# EAGLE design HandheldOsc (EAGLE 9.6.2)
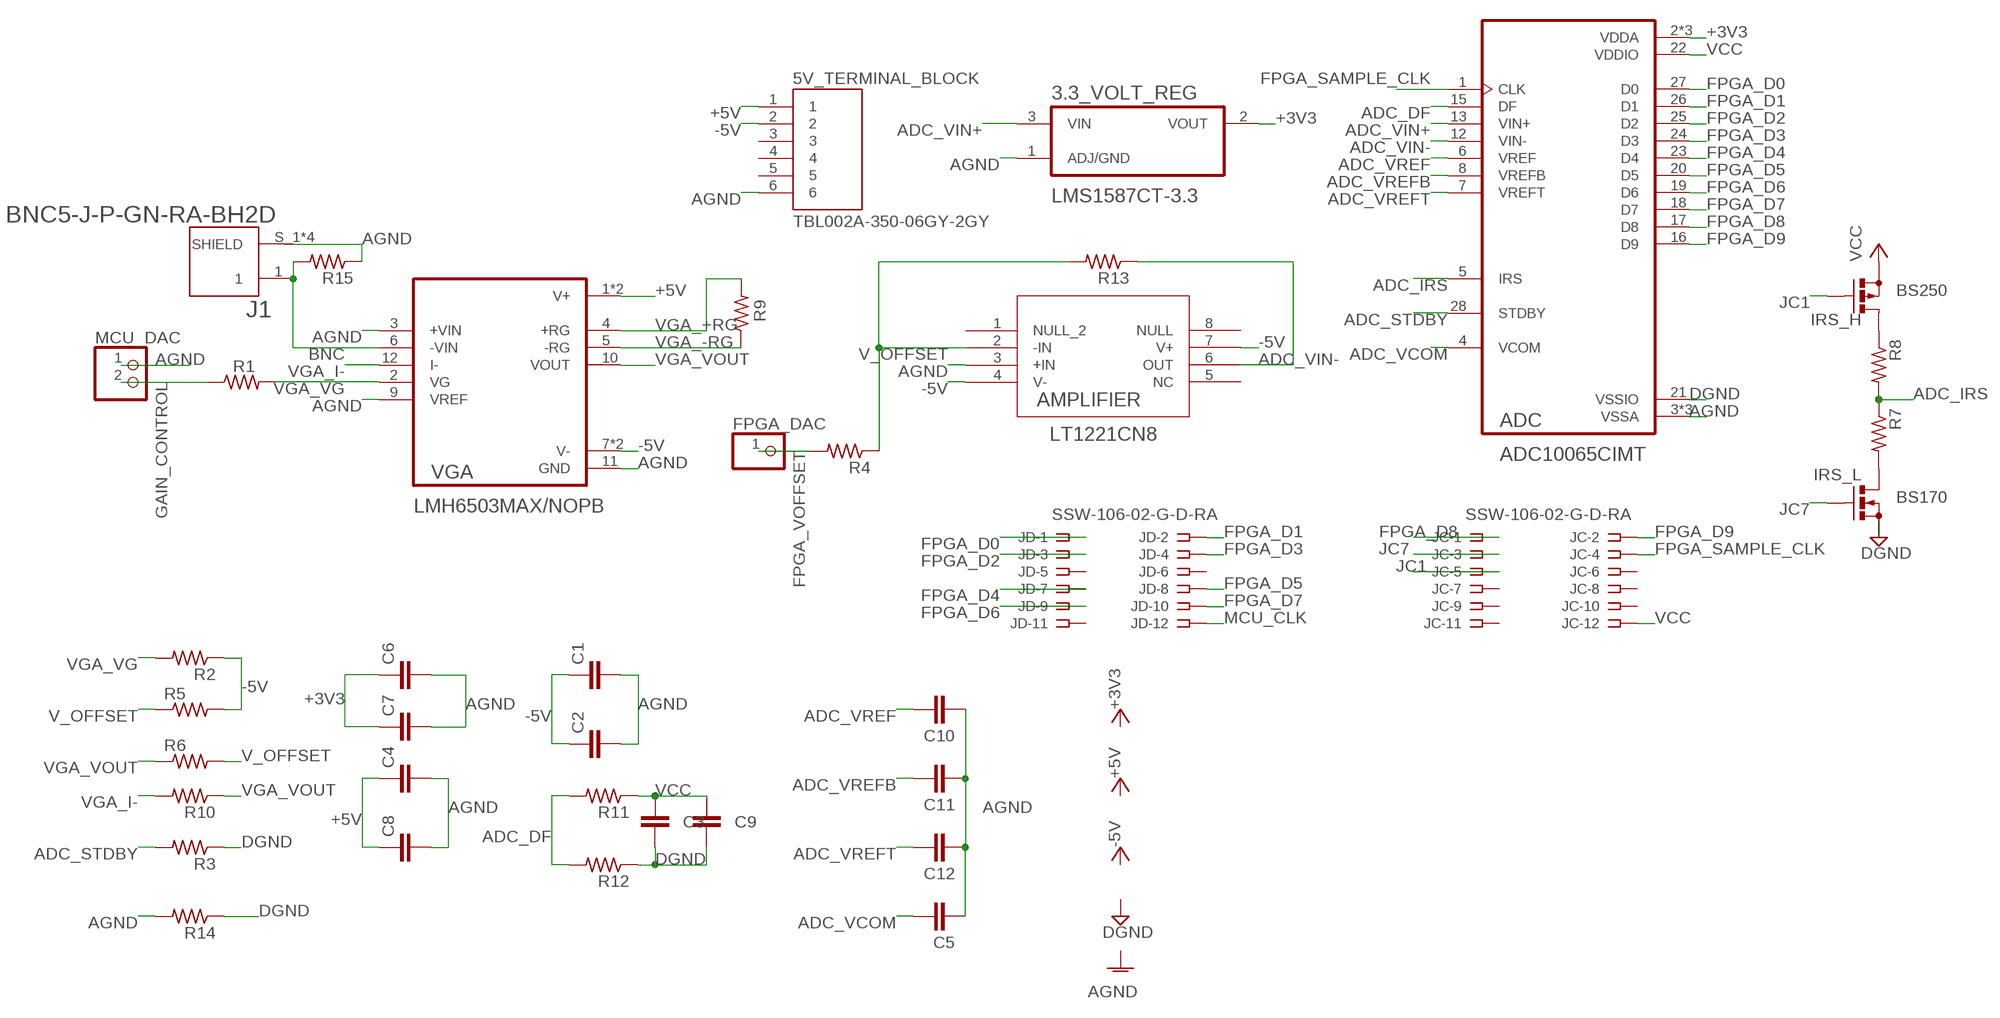
[diagram p0: schematic, sheet 1]

## Parts
3.3_VOLT_REG  LMS1587CT-3.3  [TO254P1054X470X1955-3]
5V_TERMINAL_BLOCK  TBL002A-350-06GY-2GY  [CUI_TBL002A-350-06GY-2GY]
ADC  ADC10065CIMT  [SOP65P640X120-28N]
AMPLIFIER  LT1221CN8  [PDIP-8_N]
C1  C2,5-3  [C2.5-3]
C2  C2,5-3  [C2.5-3]
C3  C2,5-3  [C2.5-3]
C4  C2,5-3  [C2.5-3]
C5  C2,5-3  [C2.5-3]
C6  C2,5-3  [C2.5-3]
C7  C2,5-3  [C2.5-3]
C8  C2,5-3  [C2.5-3]
C9  C2,5-3  [C2.5-3]
C10  C2,5-3  [C2.5-3]
C11  C2,5-3  [C2.5-3]
C12  C2,5-3  [C2.5-3]
FPGA_DAC  PINHD-1X1  [1X01]
IRS_H  BS250  [SOT54E]
IRS_L  BS170  [SOT54E]
J1  BNC5-J-P-GN-RA-BH2D  [SAMTEC_BNC5-J-P-GN-RA-BH2D]
JC  SSW-106-02-G-D-RA  [SSW-106-02-G-D-RA]
JD  SSW-106-02-G-D-RA  [SSW-106-02-G-D-RA]
MCU_DAC  PINHD-1X2  [1X02]
R1  R-US_0207/12  [0207/12]
R2  R-US_0207/12  [0207/12]
R3  R-US_0207/12  [0207/12]
R4  R-US_0207/12  [0207/12]
R5  R-US_0207/12  [0207/12]
R6  R-US_0207/12  [0207/12]
R7  R-US_0207/12  [0207/12]
R8  R-US_0207/12  [0207/12]
R9  R-US_0207/12  [0207/12]
R10  R-US_0207/12  [0207/12]
R11  R-US_0207/12  [0207/12]
R12  R-US_0207/12  [0207/12]
R13  R-US_0207/12  [0207/12]
R14  R-US_0207/12  [0207/12]
R15  R-US_0207/12  [0207/12]
VGA  LMH6503MAX/NOPB  [SOIC127P600X175-14N]

## Nets
+3V3: 3.3_VOLT_REG.2(VOUT) ADC.2(VDDA) ADC.9(VDDA) ADC.10(VDDA) C6.1 C7.1
+5V: 5V_TERMINAL_BLOCK.1 C4.1 C8.1 VGA.1(V+) VGA.14(V+)
-5V: 5V_TERMINAL_BLOCK.2 AMPLIFIER.4(V-) AMPLIFIER.7(V+) C1.1 C2.1 R2.1 R5.2 VGA.7(V-) VGA.8(V-)
ADC_DF: ADC.15(DF) R11.2 R12.2
ADC_IRS: ADC.5(IRS) R7.1 R8.2
ADC_STDBY: ADC.28(STDBY) R3.2
ADC_VCOM: ADC.4(VCOM) C5.1
ADC_VIN+: 3.3_VOLT_REG.3(VIN) ADC.13(VIN+)
ADC_VIN-: ADC.12(VIN-) AMPLIFIER.6(OUT) R13.1
ADC_VREF: ADC.6(VREF) C10.1
ADC_VREFB: ADC.8(VREFB) C11.1
ADC_VREFT: ADC.7(VREFT) C12.1
AGND: 3.3_VOLT_REG.1(ADJ/GND) 5V_TERMINAL_BLOCK.6 ADC.3(VSSA) ADC.11(VSSA) ADC.14(VSSA) AMPLIFIER.3(+IN) C1.2 C2.2 C4.2 C5.2 C6.2 C7.2 C8.2 C10.2 C11.2 C12.2 J1.S_1(SHIELD) J1.S_2(SHIELD) J1.S_3(SHIELD) J1.S_4(SHIELD) MCU_DAC.1 R14.2 R15.1 VGA.3(+VIN) VGA.9(VREF) VGA.11(GND)
BNC: J1.1 R15.2 VGA.6(-VIN)
DGND: ADC.21(VSSIO) C3.2 C9.2 IRS_L.S R3.1 R12.1 R14.1
FPGA_D0: ADC.27(D0) JD.1
FPGA_D1: ADC.26(D1) JD.2
FPGA_D2: ADC.25(D2) JD.3
FPGA_D3: ADC.24(D3) JD.4
FPGA_D4: ADC.23(D4) JD.7
FPGA_D5: ADC.20(D5) JD.8
FPGA_D6: ADC.19(D6) JD.9
FPGA_D7: ADC.18(D7) JD.10
FPGA_D8: ADC.17(D8) JC.1
FPGA_D9: ADC.16(D9) JC.2
FPGA_SAMPLE_CLK: ADC.1(CLK) JC.4
FPGA_VOFFSET: FPGA_DAC.1 R4.2
GAIN_CONTROL: MCU_DAC.2 R1.1
JC1: IRS_H.G JC.5
JC7: IRS_L.G JC.3
MCU_CLK: JD.12
N$1: IRS_H.D R8.1
N$2: IRS_L.D R7.2
V_OFFSET: AMPLIFIER.2(-IN) R4.1 R5.1 R6.2 R13.2
VCC: ADC.22(VDDIO) C3.1 C9.1 IRS_H.S JC.12 R11.1
VGA_+RG: R9.2 VGA.4(+RG)
VGA_-RG: R9.1 VGA.5(-RG)
VGA_I-: R10.2 VGA.12(I-)
VGA_VG: R1.2 R2.2 VGA.2(VG)
VGA_VOUT: R6.1 R10.1 VGA.10(VOUT)
Unconnected: 5V_TERMINAL_BLOCK.3 5V_TERMINAL_BLOCK.4 5V_TERMINAL_BLOCK.5 AMPLIFIER.1(NULL_2) AMPLIFIER.5(NC) AMPLIFIER.8(NULL) JC.6 JC.7 JC.8 JC.9 JC.10 JC.11 JD.5 JD.6 JD.11

## Library data of the parts
3.3_VOLT_REG = LMS1587CT-3.3:LMS1587CT-3.3: Check prices <https://pricing.snapeda.com/parts/LMS1587CT-3.3/NOPB/Texas%20Instruments/view-part?ref=eda>; AVAILABILITY: Warning; DESCRIPTION: 3-A, 13-V, linear voltage regulator 3-TO-220 0 to 125; MF: Texas Instruments; MP: LMS1587CT-3.3/NOPB; PACKAGE: TO-220-3 Texas Instruments; PRICE: None; PURCHASE-URL: https://pricing.snapeda.com/search/part/LMS1587CT-3.3/NOPB/?ref=eda
5V_TERMINAL_BLOCK = TBL002A-350-06GY-2GY:TBL002A-350-06GY-2GY: Check prices <https://pricing.snapeda.com/parts/TBL002A-350-06GY-2GY/CUI%20Devices/view-part?ref=eda>; AVAILABILITY: Good; CUI_PURCHASE_URL: https://www.cuidevices.com/product/interconnect/connectors/terminal-blocks/tbl002a-350-series?utm_source=snapeda.com&utm_medium=referral&utm_campaign=snapedaBOM; DESCRIPTION: 1~24 Poles, Screwless, 45°, 3.50 Pitch, 24~20 (AWG), Terminal Block Connector; MF: CUI Devices; MP: TBL002A-350-06GY-2GY; PACKAGE: None; PRICE: None; PURCHASE-URL: https://pricing.snapeda.com/search/part/TBL002A-350-06GY-2GY/?ref=eda
ADC = ADC10065CIMT:ADC10065CIMT; DESCRIPTION: 10 Bit Analog to Digital Converter 1 Input 1 Pipelined 28-TSSOP; DIGI-KEY_PART_NUMBER: 296-35231-2-ND; MF: Texas Instruments; MP: ADC10065CIMT; PACKAGE: TSSOP-28 Texas Instruments
AMPLIFIER = LT1221CN8:LT1221CN8; DESCRIPTION: General Purpose Amplifier 1 Circuit 8-PDIP; DIGI-KEY_PART_NUMBER: LT1221CN8#PBF-ND; MF: Linear Technology; MP: LT1221CN8; PACKAGE: DIP-8 Linear Technology
C1-C12 = capacitor-wima:C: CAPACITOR naming: grid - package width
FPGA_DAC = pinhead:PINHD-1X1: PIN HEADER
IRS_H = transistor-small-signal:BS250: P-CHANNEL MOS FET
IRS_L = transistor-small-signal:BS170: N-CHANNEL MOS FET
J1 = BNC5-J-P-GN-RA-BH2D:BNC5-J-P-GN-RA-BH2D: Conn BNC F 50Ohm Solder RA Thru-Hole Gold Over Nickel; DESCRIPTION: BNC Connector Jack, Female Socket 50Ohm Panel Mount, Through Hole, Right Angle Solder; DIGI-KEY_PART_NUMBER: SAM9177-ND; MF: Samtec; MP: BNC5-J-P-GN-RA-BH2D; PACKAGE: None; PURCHASE-URL: https://pricing.snapeda.com/search/part/BNC5-J-P-GN-RA-BH2D/?ref=eda
JC JD = con-samtec:SSW-106-02-G: THROUGH-HOLE .025" SQ POST SOCKET Source: Samtec SSW.pdf; MF: Samtec Inc.; MPN: SSW-106-02-G-D-RA; OC_FARNELL: unknown; OC_NEWARK: 11P9415
MCU_DAC = pinhead:PINHD-1X2: PIN HEADER
R1-R15 = rcl:R-US_: RESISTOR, American symbol; SPICEPREFIX: R
VGA = LMH6503MAX_NOPB:LMH6503MAX/NOPB; DESCRIPTION: Wideband, Low Power, Linear Variable Gain Amplifier 14-SOIC -40 to 85; DIGI-KEY_PART_NUMBER: 296-35331-1-ND; MF: Texas Instruments; MP: LMH6503MAX/NOPB; PACKAGE: SOIC-14 Texas Instruments; PURCHASE-URL: https://pricing.snapeda.com/search/part/LMH6503MAX/NOPB/?ref=eda

## Board
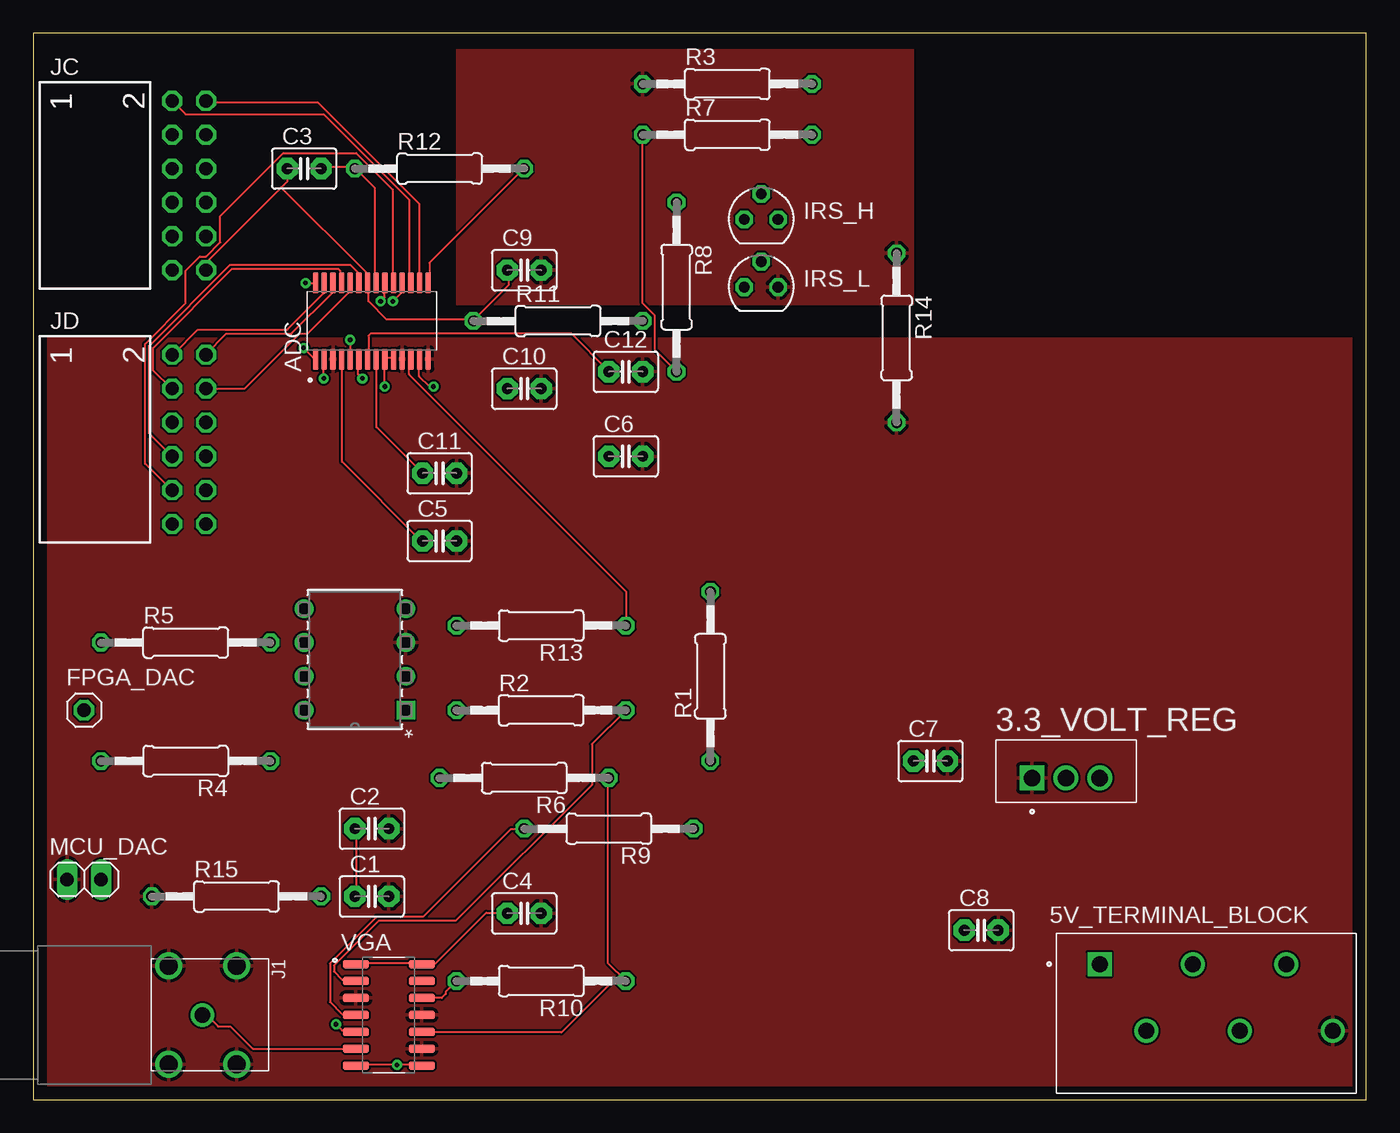
[diagram p1: board, top side]
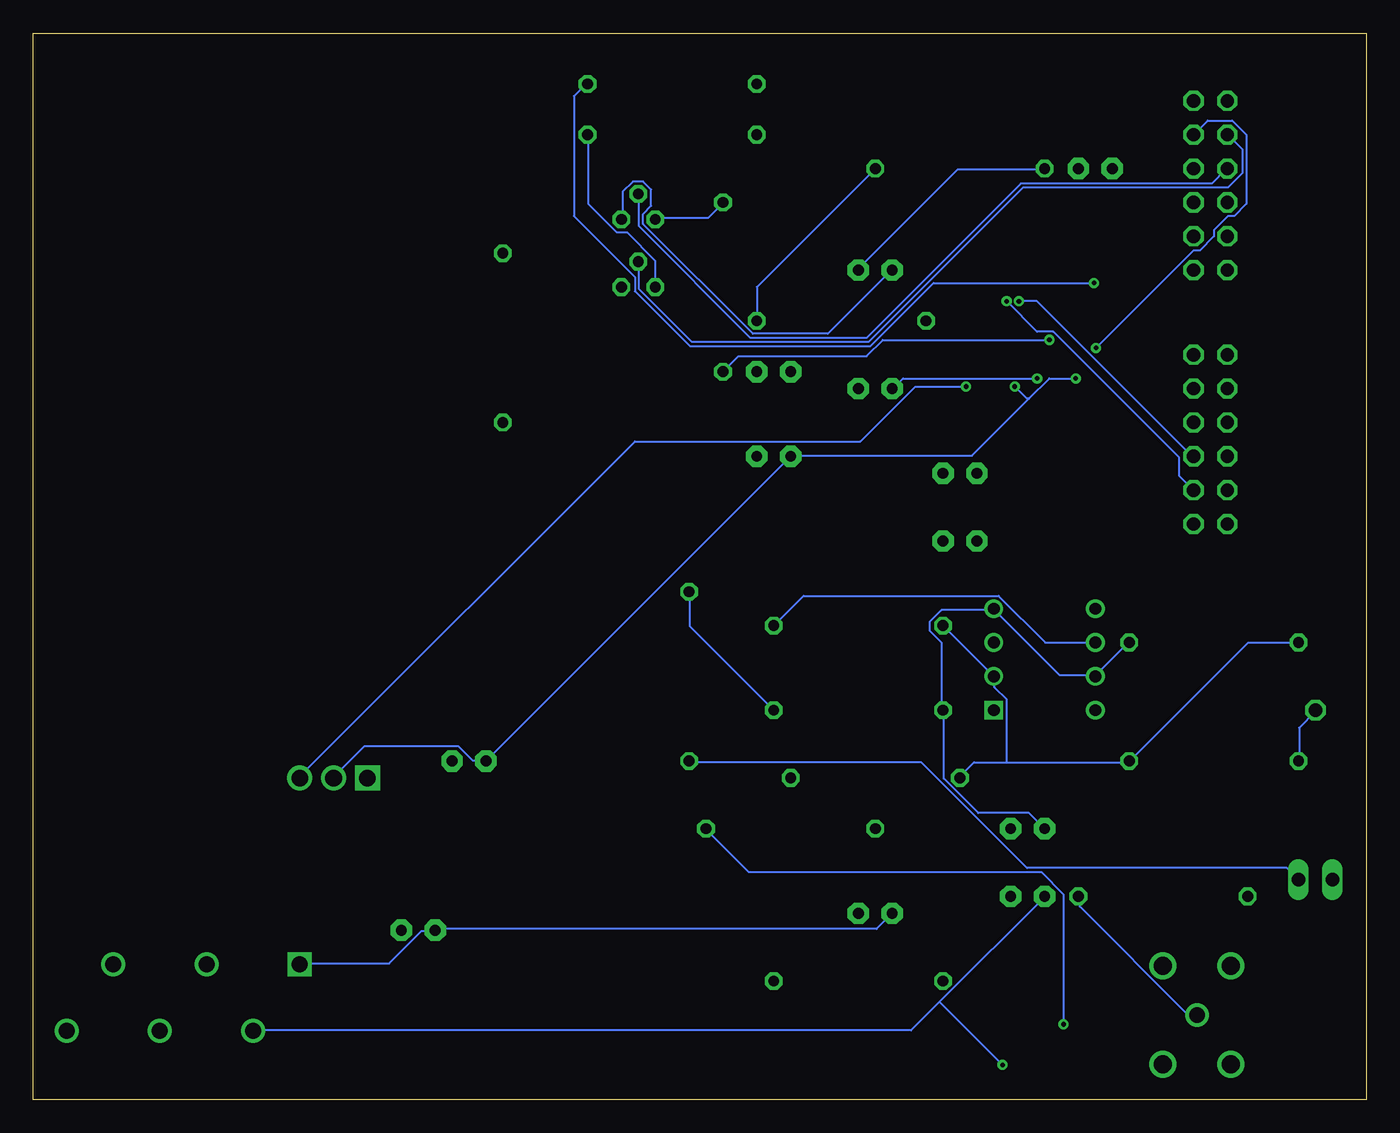
[diagram p2: board, bottom side, seen from below]

Size 100 x 80 mm. Coordinates in mm from the lower left corner, seen from the top.
Outline: 0,0 100,0 100,80 0,80 0,0
Copper layers (1*16): Top 0.035mm / dielectric 1.5mm / Bottom 0.035mm
Design rules "default": minimum track width 6mil, minimum drill 0.35mm, track to track 6mil, track to pad 6mil, pad to pad 6mil, via to via 6mil, smd to smd 6mil, copper to edge 40mil, drill to drill 6mil, minimum pad ring 10mil, minimum via ring 8mil, stop-mask expansion 4mil, vias tented up to drill 0mil, thermal gap 10mil

### Footprints (pad centres in the part's own frame; a part is rotated, then mirrored left to right if it is on the bottom)
TO254P1054X470X1955-3 = drill 1.24 square: 1 -2.54,0 | drill 1.24: 2 0,0; 3 2.54,0
CUI_TBL002A-350-06GY-2GY = drill 1.2 square: 1 0,0 | drill 1.2: 2 3.5,-5; 3 7,0; 4 10.5,-5; 5 14,0; 6 17.5,-5
SOP65P640X120-28N = smd 1.57 x 0.41: 1 -2.87,4.225; 2 -2.87,3.575; 3 -2.87,2.925; 4 -2.87,2.275; 5 -2.87,1.625; 6 -2.87,0.975; 7 -2.87,0.325; 8 -2.87,-0.325; 9 -2.87,-0.975; 10 -2.87,-1.625; 11 -2.87,-2.275; 12 -2.87,-2.925; 13 -2.87,-3.575; 14 -2.87,-4.225; 15 2.87,-4.225; 16 2.87,-3.575; 17 2.87,-2.925; 18 2.87,-2.275; 19 2.87,-1.625; 20 2.87,-0.975; 21 2.87,-0.325; 22 2.87,0.325; 23 2.87,0.975; 24 2.87,1.625; 25 2.87,2.275; 26 2.87,2.925; 27 2.87,3.575; 28 2.87,4.225
PDIP-8_N = drill 0.889 pad 1.397 square: 1 -7.62,7.62 | drill 0.889 pad 1.397: 2 -7.62,5.08; 3 -7.62,2.54; 4 -7.62,0; 5 0,0; 6 0,2.54; 7 0,5.08; 8 0,7.62
C2.5-3 = drill 0.813 pad 1.6 octagon: 1 -1.27,0; 2 1.27,0
1X01 = drill 1.016 octagon: 1 0,0
SOT54E = drill 0.813 octagon: D -1.27,0; G 0,1.905; S 1.27,0
SAMTEC_BNC5-J-P-GN-RA-BH2D = drill 1.17: 1 0,0 | drill 1.35: S_1 -3.7,-2.54; S_2 3.7,-2.54; S_3 3.7,2.54; S_4 -3.7,2.54
SSW-106-02-G-D-RA = drill 1 pad 1.5 octagon: 1 -6.35,1.524; 2 -6.35,4.064; 3 -3.81,1.524; 4 -3.81,4.064; 5 -1.27,1.524; 6 -1.27,4.064; 7 1.27,1.524; 8 1.27,4.064; 9 3.81,1.524; 10 3.81,4.064; 11 6.35,1.524; 12 6.35,4.064
1X02 = drill 1.016 long: 1 -1.27,0; 2 1.27,0
0207/12 = drill 0.813 octagon: 1 -6.35,0; 2 6.35,0
SOIC127P600X175-14N = smd 1.97 x 0.6: 1 -2.475,3.81; 2 -2.475,2.54; 3 -2.475,1.27; 4 -2.475,0; 5 -2.475,-1.27; 6 -2.475,-2.54; 7 -2.475,-3.81; 8 2.475,-3.81; 9 2.475,-2.54; 10 2.475,-1.27; 11 2.475,0; 12 2.475,1.27; 13 2.475,2.54; 14 2.475,3.81

### Placement (x,y rotation side)
3.3_VOLT_REG  77.47,24.13 0 top
5V_TERMINAL_BLOCK  80.01,10.16 0 top
ADC  25.4,58.42 90 top
AMPLIFIER  20.32,36.83 180 top
C1  25.4,15.24 0 top
C2  25.4,20.32 0 top
C3  20.32,69.85 0 top
C4  36.83,13.97 0 top
C5  30.48,41.91 0 top
C6  44.45,48.26 0 top
C7  67.31,25.4 0 top
C8  71.12,12.7 0 top
C9  36.83,62.23 0 top
C10  36.83,53.34 0 top
C11  30.48,46.99 0 top
C12  44.45,54.61 0 top
FPGA_DAC  3.81,29.21 0 top
IRS_H  54.61,66.04 0 top
IRS_L  54.61,60.96 0 top
J1  12.7,6.35 270 top
JC  8.89,68.58 270 top
JD  8.89,49.53 270 top
MCU_DAC  3.81,16.51 0 top
R1  50.8,31.75 90 top
R2  38.1,29.21 0 top
R3  52.07,76.2 0 top
R4  11.43,25.4 180 top
R5  11.43,34.29 0 top
R6  36.83,24.13 180 top
R7  52.07,72.39 0 top
R8  48.26,60.96 270 top
R9  43.18,20.32 180 top
R10  38.1,8.89 180 top
R11  39.37,58.42 0 top
R12  30.48,69.85 0 top
R13  38.1,35.56 180 top
R14  64.77,57.15 270 top
R15  15.24,15.24 0 top
VGA  26.67,6.35 0 top

### Tracks (layer width: path | path; a pad name or v marks a point on that pad's centre or on a via)
+3V3  (via drill 0.35)
  Top 0.152: ADC.10 26.98,55.63 26.52,55.63 ADC.9 26.36,55.47 v26.36,53.49 | v21.79,54.1 21.79,55.47 ADC.2
  Bottom 0.152: 3.3_VOLT_REG.2 77.42,24.23 75.13,26.52 68.12,26.52 67.06,25.45 66.14,25.45 C7.1 C6.1 43.13,48.31 29.57,48.31 25.3,52.58 | v21.79,54.1 23.77,54.1 25.3,52.58 | v26.36,53.49 25.45,52.58 25.3,52.58
+5V
  Top 0.152: VGA.1 24.23,10.21 29.11,10.21 VGA.14 29.26,10.21 30.18,10.21 33.98,14.02 35.51,14.02 C4.1
  Bottom 0.152: 5V_TERMINAL_BLOCK.1 80.01,10.21 73.3,10.21 70.87,12.65 69.95,12.65 C8.1 69.8,12.8 36.73,12.8 C4.1
-5V  (via drill 0.35)
  Top 0.152: VGA.7 24.23,2.59 v27.28,2.59 29.11,2.59 VGA.8 | C1.1 24.23,15.24 24.23,20.27 C2.1
  Bottom 0.152: R5.2 17.83,34.29 20.27,31.85 AMPLIFIER.7 20.42,31.85 23.01,31.85 27.89,36.73 AMPLIFIER.4 28.04,36.73 31.85,36.73 32.77,35.81 32.77,35.2 31.85,34.29 31.85,29.26 R2.1 31.7,29.11 31.7,24.08 29.11,21.49 25.3,21.49 C2.1 | 32,7.32 24.08,15.24 C1.1 | 32,7.32 34.14,5.18 83.36,5.18 5V_TERMINAL_BLOCK.2 | 32,7.32 v27.28,2.59
ADC_DF
  Top 0.152: ADC.15 29.72,61.42 29.72,62.79 36.73,69.8 R12.2
  Bottom 0.152: R11.2 45.72,60.96 R12.2
ADC_IRS  (via drill 0.35)
  Top 0.152: v23.77,57 23.77,55.63 ADC.5 | R7.1 45.72,59.74 46.63,58.83 46.63,56.24 R8.2
  Bottom 0.152: v23.77,57 36.27,57 37.49,55.78 47.09,55.78 R8.2
ADC_STDBY  (via drill 0.35)
  Top 0.152: v20.42,61.27 21.03,61.27 ADC.28
  Bottom 0.152: v20.42,61.27 32.46,61.27 37.19,56.54 50.75,56.54 54.86,60.66 54.86,61.72 59.44,66.29 59.44,75.29 58.52,76.2 R3.2
ADC_VCOM
  Top 0.152: ADC.4 23.16,55.47 23.16,47.85 29.11,41.91 C5.1
ADC_VIN+  (via drill 0.35)
  Top 0.152: v30.02,53.49 29.72,53.49 28.96,54.25 28.96,55.47 ADC.13
  Bottom 0.152: v30.02,53.49 33.83,53.49 37.95,49.38 54.86,49.38 80.01,24.23 3.3_VOLT_REG.3
ADC_VIN-
  Top 0.152: ADC.12 28.19,55.47 28.19,54.41 44.5,38.1 44.5,35.66 R13.1
  Bottom 0.152: AMPLIFIER.6 24.08,34.29 27.58,37.8 42.22,37.8 R13.1
ADC_VREF  (via drill 0.35)
  Top 0.152: v24.69,54.1 24.38,54.41 24.38,55.47 ADC.6
  Bottom 0.152: v24.69,54.1 34.75,54.1 35.51,53.34 C10.1
ADC_VREFB
  Top 0.152: C11.1 25.76,50.44 25.76,55.47 ADC.8
ADC_VREFT
  Top 0.152: ADC.7 25.15,55.63 25.15,57.3 25.3,57.45 40.39,57.45 43.13,54.71 C12.1
AGND
  pour Top: 0,57.15 100.33,57.15 100.33,0 0,0
BNC
  Top 0.152: VGA.6 16.46,3.81 14.78,5.49 13.87,5.49 13.11,6.25 12.8,6.25 J1.1
  Bottom 0.152: R15.2 21.49,15.24 21.49,14.48 13.41,6.4 12.8,6.4 J1.1
DGND
  Top 0.152: ADC.21 25.6,61.42 25.6,68.43 24.23,69.8 R12.1 24.08,69.95 21.64,69.95 C3.2
  Bottom 0.152: R12.1 24.23,69.8 30.63,69.8 38.1,62.33 C9.2
  pour Top: 31.75,59.69 66.04,59.69 66.04,78.74 31.75,78.74
FPGA_D0
  Top 0.152: ADC.27 21.79,61.27 21.79,60.5 19.05,57.76 12.34,57.76 10.52,55.93 JD.1
FPGA_D1
  Top 0.152: ADC.26 22.4,61.27 22.4,60.5 19.36,57.45 14.48,57.45 12.95,55.93 JD.2
FPGA_D2
  Top 0.152: ADC.25 23.01,61.42 23.01,62.18 22.86,62.33 14.94,62.33 8.99,56.39 8.99,54.71 10.36,53.34 JD.3
FPGA_D3
  Top 0.152: JD.4 15.85,53.34 19.96,57.45 20.57,57.45 23.77,60.66 23.77,61.27 ADC.24
FPGA_D4
  Top 0.152: JD.7 8.69,49.99 8.69,56.54 14.78,62.64 23.77,62.64 24.38,62.03 24.38,61.42 ADC.23
FPGA_D5  (via drill 0.35)
  Top 0.152: v26.06,59.89 26.36,60.2 26.36,61.27 ADC.20
  Bottom 0.152: v26.06,59.89 24.69,59.89 12.95,48.16 JD.8
FPGA_D6
  Top 0.152: ADC.19 26.98,61.42 26.98,68.28 24.23,71.02 18.75,71.02 14.02,66.29 14.02,64.31 12.95,63.25 12.5,63.25 11.43,62.18 11.43,59.74 8.38,56.69 8.38,47.7 10.36,45.72 JD.9
FPGA_D7  (via drill 0.35)
  Top 0.152: v26.98,59.89 27.58,60.5 27.58,61.27 ADC.18
  Bottom 0.152: v26.98,59.89 24.69,57.61 23.47,57.61 14.02,48.16 14.02,46.79 JD.10
FPGA_D8
  Top 0.152: JC.1 11.43,73.91 21.79,73.91 28.19,67.51 28.19,61.42 ADC.17
FPGA_D9
  Top 0.152: ADC.16 28.96,61.42 28.96,67.21 21.34,74.83 12.95,74.83 JC.2
FPGA_SAMPLE_CLK  (via drill 0.35)
  Top 0.152: v20.27,56.39 21.03,55.63 ADC.1
  Bottom 0.152: v20.27,56.39 12.95,63.7 12.5,63.7 11.43,64.77 11.43,65.23 10.36,66.29 9.91,66.29 8.99,67.21 8.99,72.39 10.06,73.46 11.89,73.46 JC.4
FPGA_VOFFSET
  Bottom 0.152: R4.2 5.03,25.45 5.03,27.89 3.81,29.11 FPGA_DAC.1
GAIN_CONTROL
  Bottom 0.152: MCU_DAC.2 5.94,17.37 25.45,17.37 33.38,25.3 50.75,25.3 R1.1
JC1
  Bottom 0.152: IRS_H.G 54.56,67.82 54.56,65.53 46.18,57.15 37.49,57.15 25.91,68.73 11.58,68.73 10.52,69.8 JC.5
JC7
  Bottom 0.152: IRS_L.G 54.56,62.79 54.56,60.81 50.6,56.84 37.34,56.84 25.76,68.43 10.36,68.43 9.3,69.49 9.3,71.32 10.36,72.39 JC.3
N$1
  Bottom 0.152: IRS_H.D 53.34,66.14 49.38,66.14 48.31,67.21 R8.1
N$2
  Bottom 0.152: IRS_L.D 53.34,62.94 55.47,65.08 56.24,65.08 58.37,67.21 58.37,72.39 R7.2
V_OFFSET
  Bottom 0.152: R13.2 AMPLIFIER.2 27.89,31.7 27.89,30.94 26.98,30.02 26.98,25.3 | 26.98,25.3 29.41,25.3 30.48,24.23 R6.2 | 26.98,25.3 17.83,25.3 R4.1 17.68,25.45 8.84,34.29 R5.1
VCC
  Top 0.152: JC.12 12.95,62.79 18.59,68.43 | 18.59,68.43 19.05,68.89 C3.1 | C9.1 35.66,62.18 35.66,61.11 33.07,58.52 R11.1 32.92,58.52 26.52,58.52 25.15,59.89 25.15,61.27 ADC.22 24.99,61.42 24.99,62.03 18.59,68.43
  Bottom 0.152: IRS_H.S 55.78,66.14 55.78,68.12 55.02,68.89 54.25,68.89 53.65,68.28 53.65,67.06 54.25,66.45 54.25,65.68 46.02,57.45 40.39,57.45 35.66,62.18 C9.1
VGA_+RG
  Top 0.152: VGA.4 24.08,6.4 23.16,6.4 22.25,7.32 22.25,10.21 25.76,13.72 29.26,13.72 35.81,20.27 36.73,20.27 R9.2
VGA_-RG  (via drill 0.35)
  Top 0.152: v22.71,5.64 23.16,5.18 24.08,5.18 VGA.5
  Bottom 0.152: v22.71,5.64 22.71,15.39 24.38,17.07 46.33,17.07 49.53,20.27 R9.1
VGA_I-
  Top 0.152: VGA.12 30.63,7.62 30.94,7.92 30.94,8.08 R10.2
VGA_VG
  Top 0.152: R2.2 41.91,26.67 41.91,23.62 31.7,13.41 25.91,13.41 22.55,10.06 22.55,9.6 23.16,8.99 24.08,8.99 VGA.2
  Bottom 0.152: R2.2 50.75,35.51 50.75,38.1 R1.2
VGA_VOUT
  Top 0.152: VGA.10 29.26,5.03 39.62,5.03 43.43,8.84 44.35,8.84 R10.1 43.13,10.21 43.13,24.08 R6.1